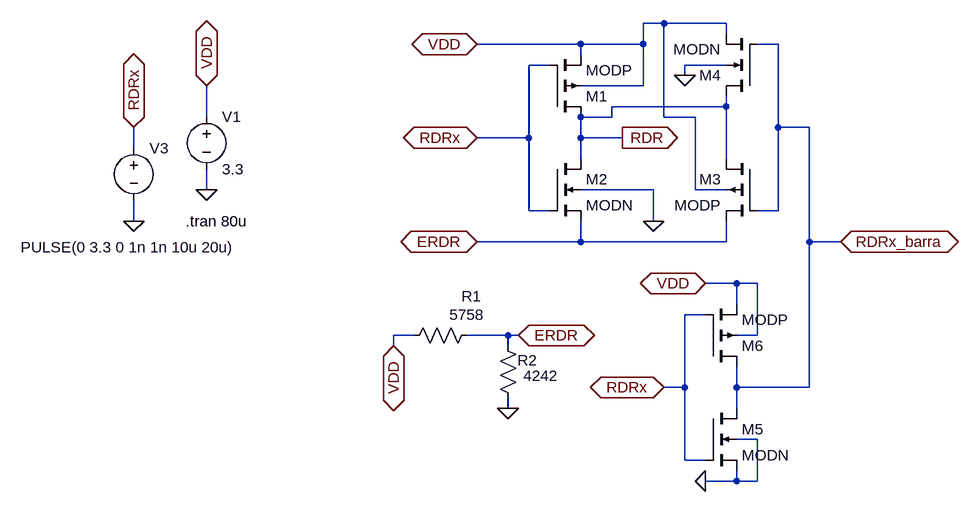
[diagram p0: schematic RDR NOVO.asc]
RDR NOVO.asc, the LTspice schematic file:
Version 4
SHEET 1 1124 680
WIRE 336 -848 304 -848
WIRE 432 -848 336 -848
WIRE 432 -832 432 -848
WIRE 208 -816 48 -816
WIRE 304 -816 304 -848
WIRE 304 -816 208 -816
WIRE 512 -816 480 -816
WIRE 208 -800 208 -816
WIRE 160 -784 128 -784
WIRE 432 -784 368 -784
WIRE 368 -768 368 -784
WIRE 304 -752 304 -816
WIRE 304 -752 208 -752
WIRE 432 -720 432 -736
WIRE 432 -720 256 -720
WIRE -368 -704 -368 -752
WIRE 256 -704 256 -720
WIRE 256 -704 208 -704
WIRE 336 -704 336 -848
WIRE 384 -704 336 -704
WIRE 512 -688 512 -816
WIRE 560 -688 512 -688
WIRE 128 -672 128 -784
WIRE 128 -672 48 -672
WIRE 208 -672 208 -704
WIRE 272 -672 208 -672
WIRE -480 -656 -480 -688
WIRE 208 -640 208 -672
WIRE 432 -640 432 -720
WIRE -368 -592 -368 -624
WIRE 320 -592 208 -592
WIRE 384 -592 384 -704
WIRE 432 -592 384 -592
WIRE 128 -560 128 -672
WIRE 160 -560 128 -560
WIRE 512 -560 512 -688
WIRE 512 -560 480 -560
WIRE -480 -544 -480 -576
WIRE 320 -544 320 -592
WIRE 208 -512 208 -544
WIRE 208 -512 48 -512
WIRE 432 -512 432 -544
WIRE 432 -512 208 -512
WIRE 560 -512 560 -688
WIRE 608 -512 560 -512
WIRE 448 -448 400 -448
WIRE 480 -448 448 -448
WIRE 448 -416 448 -448
WIRE 400 -400 368 -400
WIRE -48 -368 -80 -368
WIRE 96 -368 32 -368
WIRE 112 -368 96 -368
WIRE 480 -368 480 -448
WIRE 480 -368 448 -368
WIRE -80 -352 -80 -368
WIRE 96 -352 96 -368
WIRE 368 -288 368 -400
WIRE 368 -288 336 -288
WIRE 448 -288 448 -320
WIRE 560 -288 560 -512
WIRE 560 -288 448 -288
WIRE 96 -256 96 -272
WIRE 448 -256 448 -288
WIRE 480 -208 448 -208
WIRE 368 -176 368 -288
WIRE 400 -176 368 -176
WIRE 448 -144 448 -160
WIRE 448 -144 400 -144
WIRE 480 -144 480 -208
WIRE 480 -144 448 -144
FLAG 320 -544 0
FLAG 272 -672 RDR
IOPIN 272 -672 Out
FLAG 48 -816 VDD
IOPIN 48 -816 BiDir
FLAG 48 -672 RDRx
IOPIN 48 -672 BiDir
FLAG 48 -512 ERDR
IOPIN 48 -512 BiDir
FLAG -368 -592 0
FLAG -368 -752 VDD
IOPIN -368 -752 BiDir
FLAG -480 -544 0
FLAG -480 -688 RDRx
IOPIN -480 -688 BiDir
FLAG 368 -768 0
FLAG 400 -448 VDD
IOPIN 400 -448 BiDir
FLAG 400 -144 0
FLAG 336 -288 RDRx
IOPIN 336 -288 BiDir
FLAG 608 -512 RDRx_barra
IOPIN 608 -512 BiDir
FLAG 96 -256 0
FLAG -80 -352 VDD
IOPIN -80 -352 BiDir
FLAG 112 -368 ERDR
IOPIN 112 -368 BiDir
SYMBOL pmos4 160 -704 M180
SYMATTR InstName M1
SYMATTR Value MODP
SYMATTR Value2 l=0.35u w=0.70u
SYMBOL nmos4 160 -640 R0
SYMATTR InstName M2
SYMATTR Value MODN
SYMATTR Value2 l=0.35u w=0.7u
SYMBOL voltage -368 -720 R0
SYMATTR InstName V1
SYMATTR Value 3.3
SYMBOL voltage -480 -672 R0
WINDOW 123 0 0 Left 2
WINDOW 39 0 0 Left 2
WINDOW 3 -174 168 Left 2
SYMATTR Value PULSE(0 3.3 0 1n 1n 10u 20u)
SYMATTR InstName V3
SYMBOL pmos4 480 -640 M0
SYMATTR InstName M3
SYMATTR Value MODP
SYMATTR Value2 l=0.35u w=0.7u
SYMBOL nmos4 480 -736 R180
SYMATTR InstName M4
SYMATTR Value MODN
SYMATTR Value2 l=0.35u w=0.7u
SYMBOL nmos4 400 -256 R0
SYMATTR InstName M5
SYMATTR Value MODN
SYMATTR Value2 l=0.35u w=0.7u
SYMBOL pmos4 400 -320 M180
SYMATTR InstName M6
SYMATTR Value MODP
SYMATTR Value2 l=0.35u w=0.7u
SYMBOL res 48 -384 R90
WINDOW 0 -29 8 VBottom 2
WINDOW 3 -31 15 VTop 2
SYMATTR InstName R1
SYMATTR Value 5758
SYMBOL res 112 -256 R180
WINDOW 0 -29 74 Left 2
WINDOW 3 -62 50 Left 2
SYMATTR InstName R2
SYMATTR Value 4242
TEXT -400 -544 Left 2 !.tran 80u

The netlist it stands for:
* RDR NOVO.asc
M1 RDR RDRx VDD VDD MODP l=0.35u w=0.70u
M2 RDR RDRx ERDR 0 MODN l=0.35u w=0.7u
V1 VDD 0 3.3
V3 RDRx 0 PULSE(0 3.3 0 1n 1n 10u 20u)
M3 RDR RDRx_barra ERDR VDD MODP l=0.35u w=0.7u
M4 RDR RDRx_barra VDD 0 MODN l=0.35u w=0.7u
M5 RDRx_barra RDRx 0 0 MODN l=0.35u w=0.7u
M6 RDRx_barra RDRx VDD VDD MODP l=0.35u w=0.7u
R1 ERDR VDD 5758
R2 0 ERDR 4242
.model NMOS NMOS
.model PMOS PMOS
.lib standard.mos
.tran 80u
.backanno
.end